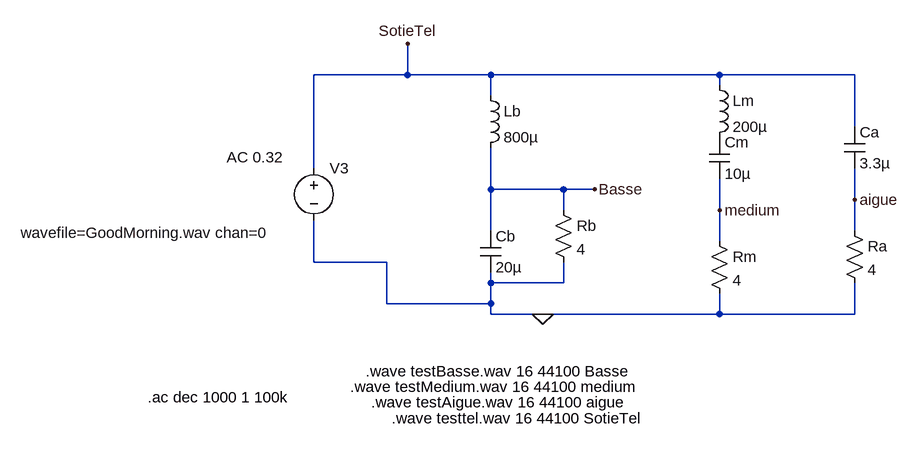
[diagram p0: schematic Draft8.asc]
Draft8.asc, the LTspice schematic file:
Version 4
SHEET 1 4624 800
WIRE 2304 144 2304 96
WIRE 2304 144 2160 144
WIRE 2432 144 2304 144
WIRE 2784 144 2432 144
WIRE 2992 144 2784 144
WIRE 2784 160 2784 144
WIRE 2432 176 2432 144
WIRE 2992 224 2992 144
WIRE 2160 288 2160 144
WIRE 2432 320 2432 256
WIRE 2544 320 2432 320
WIRE 2592 320 2544 320
WIRE 2992 336 2992 288
WIRE 2544 352 2544 320
WIRE 2784 352 2784 304
WIRE 2432 384 2432 320
WIRE 2992 384 2992 336
WIRE 2784 400 2784 352
WIRE 2160 432 2160 368
WIRE 2272 432 2160 432
WIRE 2432 464 2432 448
WIRE 2544 464 2544 432
WIRE 2544 464 2432 464
WIRE 2272 496 2272 432
WIRE 2432 496 2432 464
WIRE 2432 496 2272 496
WIRE 2432 512 2432 496
WIRE 2512 512 2432 512
WIRE 2784 512 2784 480
WIRE 2784 512 2512 512
WIRE 2992 512 2992 464
WIRE 2992 512 2784 512
FLAG 2592 320 Basse
FLAG 2784 352 medium
FLAG 2992 336 aigue
FLAG 2512 512 0
FLAG 2304 96 SotieTel
SYMBOL voltage 2160 272 R0
WINDOW 123 -134 -1 Left 2
WINDOW 39 0 0 Left 0
WINDOW 3 -451 115 Left 2
SYMATTR Value2 AC 0.32
SYMATTR Value wavefile=GoodMorning.wav chan=0
SYMATTR InstName V3
SYMBOL ind 2416 160 R0
SYMATTR InstName Lb
SYMATTR Value 800µ
SYMBOL res 2528 336 R0
SYMATTR InstName Rb
SYMATTR Value 4
SYMBOL res 2768 384 R0
SYMATTR InstName Rm
SYMATTR Value 4
SYMBOL cap 2976 224 R0
SYMATTR InstName Ca
SYMATTR Value 3.3µ
SYMBOL res 2976 368 R0
SYMATTR InstName Ra
SYMATTR Value 4
SYMBOL cap 2416 384 R0
SYMATTR InstName Cb
SYMATTR Value 20µ
SYMBOL ind 2768 144 R0
SYMATTR InstName Lm
SYMATTR Value 200µ
SYMBOL cap 2768 240 R0
SYMATTR InstName Cm
SYMATTR Value 10µ
TEXT 1904 640 Left 2 !.ac dec 1000 1 100k
TEXT 2240 600 Left 2 !.wave testBasse.wav 16 44100 Basse
TEXT 2216 624 Left 2 !.wave testMedium.wav 16 44100 medium
TEXT 2248 648 Left 2 !.wave testAigue.wav 16 44100 aigue
TEXT 2280 672 Left 2 !.wave testtel.wav 16 44100 SotieTel

The netlist it stands for:
* Draft8.asc
V3 SotieTel 0 wavefile=GoodMorning.wav chan=0 AC 0.32
Lb SotieTel Basse 800µ
Rb Basse 0 4
Rm medium 0 4
Ca SotieTel aigue 3.3µ
Ra aigue 0 4
Cb Basse 0 20µ
Lm SotieTel P001 200µ
Cm P001 medium 10µ
.ac dec 1000 1 100k
.wave testBasse.wav 16 44100 Basse
.wave testMedium.wav 16 44100 medium
.wave testAigue.wav 16 44100 aigue
.wave testtel.wav 16 44100 SotieTel
.backanno
.end

* Results of the author's LTspice run, read from the files saved beside the schematic
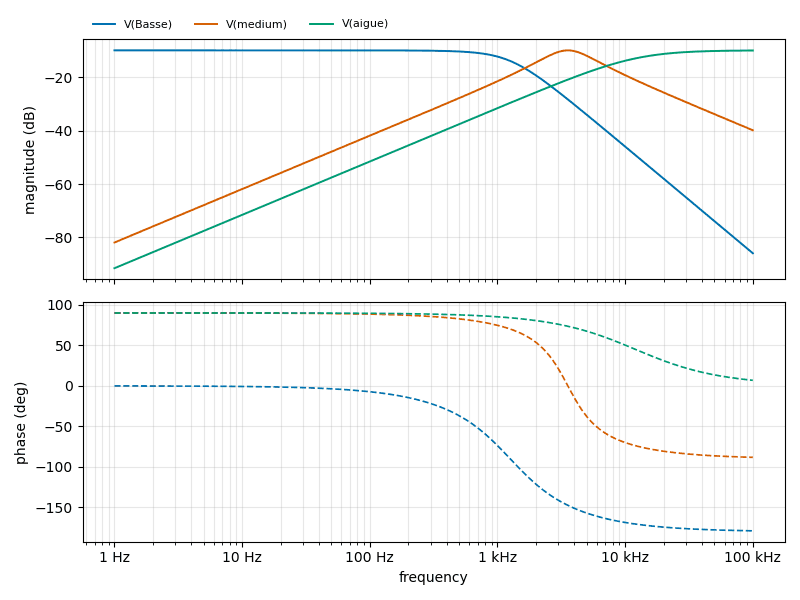
[diagram p1: AC Analysis of Draft8.asc, plotted from the saved traces]
* AC Analysis, 1 run:
*   V(Basse): -9.90 dB at 1 Hz, -85.91 dB at 100 kHz, peak -9.90 dB at 1 Hz, 3 dB below the peak at 1.112 kHz
*   V(medium): -81.89 dB at 1 Hz, -39.83 dB at 100 kHz, peak -9.90 dB at 3.556 kHz, 3 dB below the peak at 2.307 kHz and 5.491 kHz
*   V(aigue): -91.52 dB at 1 Hz, -9.96 dB at 100 kHz, peak -9.96 dB at 100 kHz, 3 dB below the peak at 11.89 kHz